# EasyEDA schematic SCH_ECG-business-card_2025-07-31.json
TITLE: ECG Business Card; REV: 1.0; Date: 2025-07-29; Sheet: 1/1; Drawn By: Ali Ashrafy; Company: Ashrafy Industries
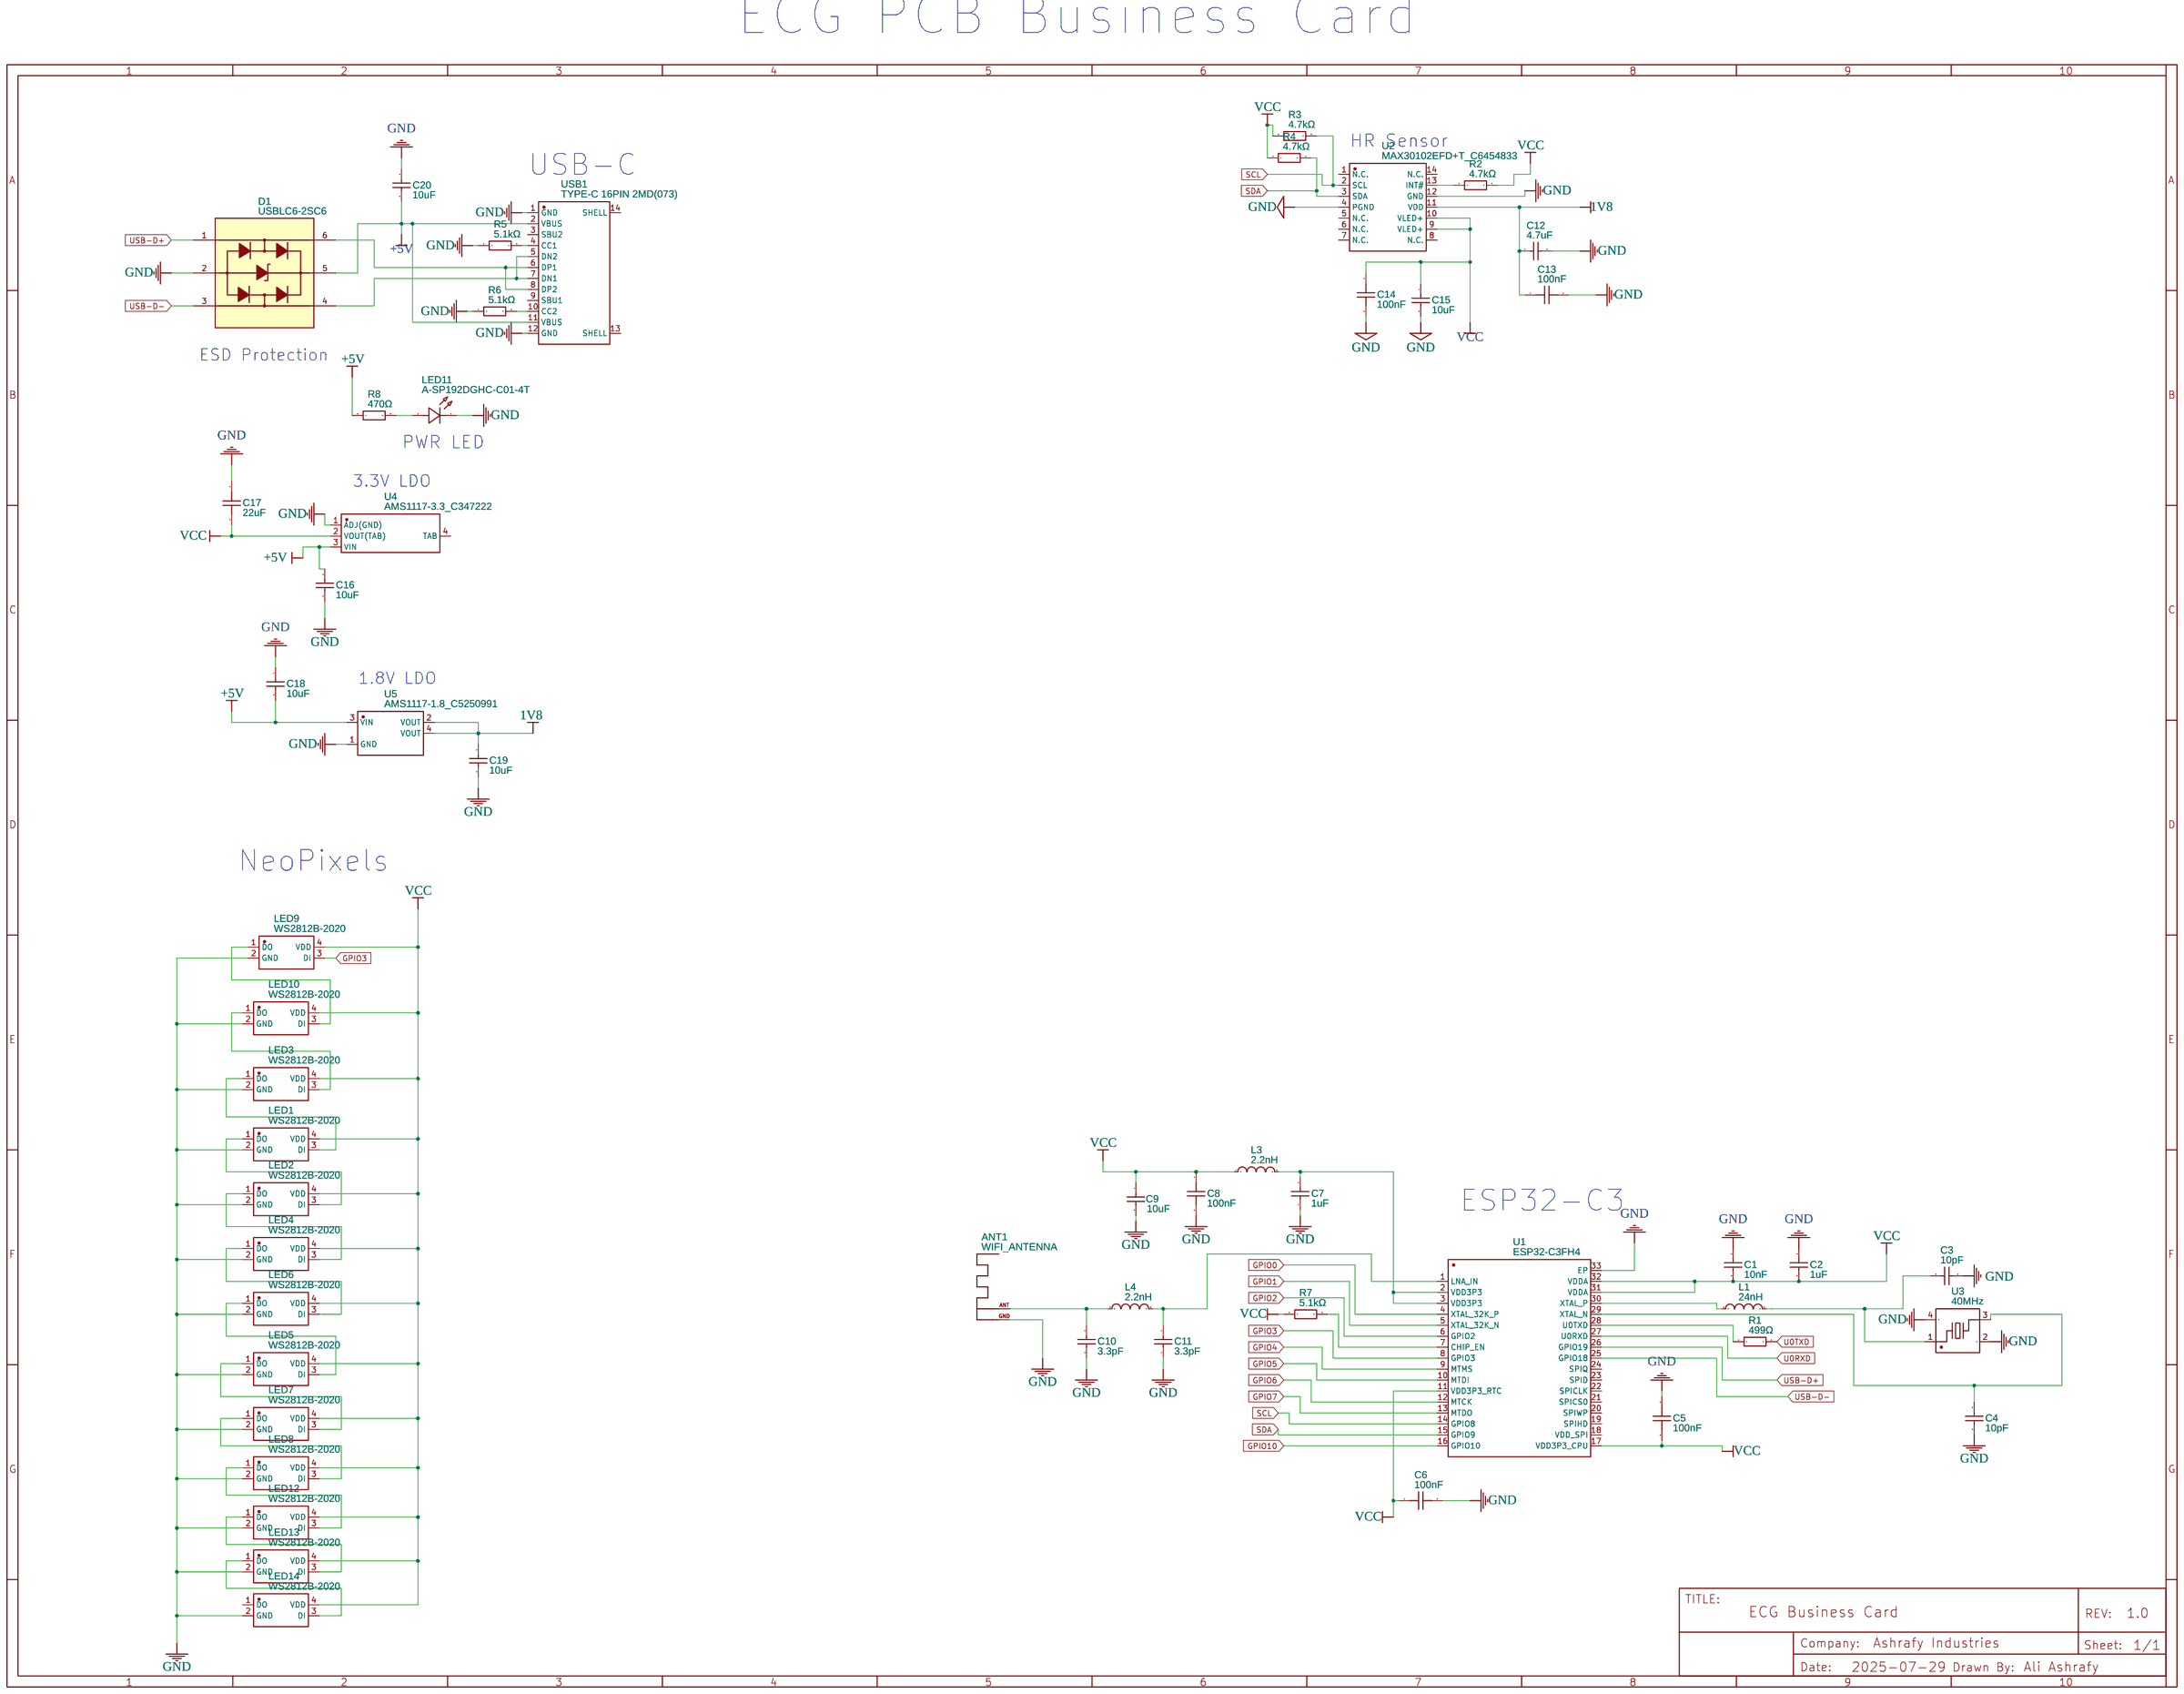
[diagram p0: schematic sheet]

## Parts
ANT1  WIFI_ANTENNA  [WIFI ANTENNA MIFA INVERTED F ANTENNA]
C1  10nF  [C0603]
C2  1uF  [C0805]
C3  10pF  [C0402]
C4  10pF  [C0402]
C5  100nF  [C0603]
C6  100nF  [C0603]
C7  1uF  [C0805]
C8  100nF  [C0603]
C9  10uF  [C1206]
C10  3.3pF  [C0402]
C11  3.3pF  [C0402]
C12  4.7uF  [C0603]
C13  100nF  [C0603]
C14  100nF  [C0603]
C15  10uF  [C1206]
C16  10uF  [C1206]
C17  22uF  [C0805]
C18  10uF  [C1206]
C19  10uF  [C1206]
C20  10uF  [C1206]
D1  USBLC6-2SC6  [SOT-23-6_L2.9-W1.6-P0.95-LS2.8-BL]
L1  24nH  [L0201]
L3  2.2nH  [L0402]
L4  2.2nH  [L0402]
LED1  WS2812B-2020  [LED-SMD_4P-L2.0-W2.0-TL_WS2812B-2020]
LED2  WS2812B-2020  [LED-SMD_4P-L2.0-W2.0-TL_WS2812B-2020]
LED3  WS2812B-2020  [LED-SMD_4P-L2.0-W2.0-TL_WS2812B-2020]
LED4  WS2812B-2020  [LED-SMD_4P-L2.0-W2.0-TL_WS2812B-2020]
LED5  WS2812B-2020  [LED-SMD_4P-L2.0-W2.0-TL_WS2812B-2020]
LED6  WS2812B-2020  [LED-SMD_4P-L2.0-W2.0-TL_WS2812B-2020]
LED7  WS2812B-2020  [LED-SMD_4P-L2.0-W2.0-TL_WS2812B-2020]
LED8  WS2812B-2020  [LED-SMD_4P-L2.0-W2.0-TL_WS2812B-2020]
LED9  WS2812B-2020  [LED-SMD_4P-L2.0-W2.0-TL_WS2812B-2020]
LED10  WS2812B-2020  [LED-SMD_4P-L2.0-W2.0-TL_WS2812B-2020]
LED11  A-SP192DGHC-C01-4T  [LED0603-FD]
LED12  WS2812B-2020  [LED-SMD_4P-L2.0-W2.0-TL_WS2812B-2020]
LED13  WS2812B-2020  [LED-SMD_4P-L2.0-W2.0-TL_WS2812B-2020]
LED14  WS2812B-2020  [LED-SMD_4P-L2.0-W2.0-TL_WS2812B-2020]
R1  499Ω  [R0402]
R2  4.7kΩ  [R0603]
R3  4.7kΩ  [R0603]
R4  4.7kΩ  [R0603]
R5  5.1kΩ  [R0603]
R6  5.1kΩ  [R0603]
R7  5.1kΩ  [R0603]
R8  470Ω  [R0603]
U1  ESP32-C3FH4  [QFN-32_L5.0-W5.0-P0.50-TL-EP3.7]
U2  MAX30102EFD+T_C6454833  [OESIP-14_L5.6-W3.3-P0.80-TL]
U3  40MHz  [CRYSTAL-SMD_4P-L3.2-W2.5-BL]
U4  AMS1117-3.3_C347222  [SOT-223-4_L6.5-W3.5-P2.30-LS7.0-BR]
U5  AMS1117-1.8_C5250991  [SOT-223-3_L6.7-W3.7-P2.30-LS7.0-BR]
USB1  TYPE-C 16PIN 2MD(073)  [USB-C-SMD_TYPE-C-6PIN-2MD-073]

## Library data of the parts
ANT1 = WIFI_ANTENNA: Contributor: Schinken
C1 = CC0603KRX7R9BB103: Supplier: LCSC; Manufacturer: YAGEO(国巨); Supplier Part: C100042; JLCPCB Part Class: Extended Part
C2 C7 = CL21B105KBFNNNE: Supplier: LCSC; Manufacturer: SAMSUNG(三星); Supplier Part: C28323; JLCPCB Part Class: Basic Part
C3 C4 = GRM1555C1H100JA01D: Supplier: LCSC; Manufacturer: muRata(村田); Supplier Part: C76946; JLCPCB Part Class: Extended Part
C5 C8 C13 C14 = CC0603KRX7R9BB104: Supplier: LCSC; Manufacturer: YAGEO(国巨); Supplier Part: C14663; JLCPCB Part Class: Basic Part
C6 = CC0603KRX7R9BB104: Supplier: LCSC; Manufacturer: YAGEO(国巨); Supplier Part: C14663; JLCPCB Part Class: Basic Part; link: https://lcsc.com/eda_search?q=C14663&%26type=1&ref=editor
C9 C15 C16 C18 C19 = CL31A106KBHNNNE: Supplier: LCSC; Manufacturer: SAMSUNG(三星); Supplier Part: C13585; JLCPCB Part Class: Basic Part
C10 C11 = GJM1555C1H3R3BB01D: Supplier: LCSC; Manufacturer: muRata(村田); Supplier Part: C76906; JLCPCB Part Class: Extended Part
C12 = CL10A475KP8NNNC: Supplier: LCSC; Manufacturer: SAMSUNG(三星); Supplier Part: C1705; JLCPCB Part Class: Extended Part
C17 = CL21A226MAYNNNE: Contributor: LCSC; Supplier: LCSC; Supplier Part: C602037; Manufacturer: SAMSUNG(三星); JLCPCB Part Class: Extended Part
C20 = CL31A106KBHNNNE: Supplier: LCSC; Manufacturer: SAMSUNG(三星); Supplier Part: C13585; JLCPCB Part Class: Basic Part; link: https://lcsc.com/eda_search?q=C13585&%26type=1&ref=editor
D1 = USBLC6-2SC6: Supplier: LCSC; Manufacturer: ST(意法半导体); Supplier Part: C7519; JLCPCB Part Class: Extended Part
L1 = LQP03TN24NH02D: Contributor: LCSC; Supplier: LCSC; Supplier Part: C206441; Manufacturer: muRata(村田); JLCPCB Part Class: Extended Part
L3 L4 = LQG15HS2N2S02D: Supplier: LCSC; Manufacturer: muRata(村田); Supplier Part: C86061; JLCPCB Part Class: Extended Part
LED1-LED10 LED12-LED14 = WS2812B-2020: Contributor: LCSC; Supplier: LCSC; Supplier Part: C965555; Manufacturer: worldsemi; JLCPCB Part Class: Extended Part
LED11 = A-SP192DGHC-C01-4T: Supplier: LCSC; Supplier Part: C19171301; Manufacturer: Amicc(欧密格光电); JLCPCB Part Class: Extended Part; Contributor: lcsc
R1 = RC0402FR-07499RL: Supplier: LCSC; Manufacturer: YAGEO(国巨); Supplier Part: C137970; JLCPCB Part Class: Extended Part
R2-R4 = RC0603FR-074K7L: Supplier: LCSC; Manufacturer: YAGEO(国巨); Supplier Part: C99782; JLCPCB Part Class: Extended Part
R5-R7 = RC0603FR-075K1L: Supplier: LCSC; Manufacturer: YAGEO(国巨); Supplier Part: C105580; JLCPCB Part Class: Extended Part
R8 = RC0603FR-07470RL: Supplier: LCSC; Manufacturer: YAGEO(国巨); Supplier Part: C114669; JLCPCB Part Class: Extended Part
U1 = ESP32-C3FH4: Contributor: LCSC; Supplier: LCSC; Supplier Part: C2858491; Manufacturer: ESPRESSIF(乐鑫); JLCPCB Part Class: Extended Part; Package Display: No
U2 = MAX30102EFD+T_C6454833: Supplier: LCSC; Supplier Part: C6454833; Manufacturer: ADI(亚德诺)/MAXIM(美信); Manufacturer Part: MAX30102EFD+T; JLCPCB Part Class: Extended Part
U3 = L327S400H11L: Supplier: LCSC; Supplier Part: C5261245; Manufacturer: Lucki(蓝晶); Contributor: lcsc; JLCPCB Part Class: Extended Part
U4 = AMS1117-3.3_C347222: Contributor: LCSC; Supplier: LCSC; Supplier Part: C347222; Manufacturer: UMW(友台半导体); Manufacturer Part: AMS1117-3.3; JLCPCB Part Class: Extended Part
U5 = AMS1117-1.8_C5250991: Supplier: LCSC; Supplier Part: C5250991; Manufacturer: TWGMC(台湾迪嘉); Manufacturer Part: AMS1117-1.8; JLCPCB Part Class: Extended Part; Contributor: lcsc
USB1 = TYPE-C 16PIN 2MD(073): Contributor: LCSC; Supplier: LCSC; Supplier Part: C2765186; Manufacturer: SHOU HAN(首韩); JLCPCB Part Class: Extended Part

## Nets
1V8: C12.1 C13.1 C19.1 U2.11(VDD) U5.2(VOUT) U5.4(VOUT)
+5V: C16.1 C18.2 C20.2 D1.5 R8.1 U4.3(VIN) U5.3(VIN) USB1.2(VBUS) USB1.11(VBUS)
GND: ANT1.GND C1.2 C2.2 C3.2 C4.2 C5.1 C6.2 C7.1 C8.2 C9.2 C10.1 C11.1 C12.2 C13.2 C14.2 C15.2 C16.2 C17.1 C18.1 C19.2 C20.1 D1.2 LED1.2(GND) LED2.2(GND) LED3.2(GND) LED4.2(GND) LED5.2(GND) LED6.2(GND) LED7.2(GND) LED8.2(GND) LED9.2(GND) LED10.2(GND) LED11.2(K) LED12.2(GND) LED13.2(GND) LED14.2(GND) R5.1 R6.1 U1.33(EP) U2.4(PGND) U2.12(GND) U3.2(GND) U3.4(GND) U4.1(ADJ(GND)) U5.1(GND) USB1.1(GND) USB1.12(GND)
VCC: C1.1 C2.1 C5.2 C6.1 C8.1 C9.1 C14.1 C15.1 C17.2 L3.1 LED1.4(VDD) LED2.4(VDD) LED3.4(VDD) LED4.4(VDD) LED5.4(VDD) LED6.4(VDD) LED7.4(VDD) LED8.4(VDD) LED9.4(VDD) LED10.4(VDD) LED12.4(VDD) LED13.4(VDD) LED14.4(VDD) R2.2 R3.1 R4.1 R7.1 U1.11(VDD3P3_RTC) U1.17(VDD3P3_CPU) U1.31(VDDA) U1.32(VDDA) U2.9(VLED+) U2.10(VLED+) U4.2(VOUT(TAB))
GPIO0: U1.4(XTAL_32K_P)
GPIO1: U1.5(XTAL_32K_N)
GPIO2: U1.6(GPIO2)
GPIO3: LED9.3(DI) U1.8(GPIO3)
GPIO4: U1.9(MTMS)
GPIO5: U1.10(MTDI)
GPIO6: U1.12(MTCK)
GPIO7: U1.13(MTDO)
GPIO10: U1.16(GPIO10)
SCL: R3.2 U1.14(GPIO8) U2.2(SCL)
SDA: R4.2 U1.15(GPIO9) U2.3(SDA)
U0RXD: U1.27(U0RXD)
U0TXD: R1.2
USB-D+: D1.1 U1.26(GPIO19)
USB-D-: D1.3 U1.25(GPIO18)
Net-(ANT1-ANT): ANT1.ANT C10.2 L4.1
Net-(C3-1): C3.1 L1.2 U3.1
Net-(C4-1): C4.1 U1.29(XTAL_N) U3.3
Net-(C7-2): C7.2 L3.2 U1.2(VDD3P3) U1.3(VDD3P3)
Net-(C11-2): C11.2 L4.2 U1.1(LNA_IN)
Net-(D1-4): D1.4 USB1.5(DN2) USB1.7(DN1)
Net-(D1-6): D1.6 USB1.6(DP1) USB1.8(DP2)
Net-(L1-1): L1.1 U1.30(XTAL_P)
Net-(LED1-1): LED1.1(DO) LED2.3(DI)
Net-(LED1-3): LED1.3(DI) LED3.1(DO)
Net-(LED2-1): LED2.1(DO) LED4.3(DI)
Net-(LED3-3): LED3.3(DI) LED10.1(DO)
Net-(LED4-1): LED4.1(DO) LED6.3(DI)
Net-(LED5-1): LED5.1(DO) LED7.3(DI)
Net-(LED5-3): LED5.3(DI) LED6.1(DO)
Net-(LED7-1): LED7.1(DO) LED8.3(DI)
Net-(LED8-1): LED8.1(DO) LED12.3(DI)
Net-(LED9-1): LED9.1(DO) LED10.3(DI)
Net-(LED11-1): LED11.1(A) R8.2
Net-(LED12-1): LED12.1(DO) LED13.3(DI)
Net-(LED13-1): LED13.1(DO) LED14.3(DI)
Net-(R1-1): R1.1 U1.28(U0TXD)
Net-(R2-1): R2.1 U2.13(INT#)
Net-(R5-2): R5.2 USB1.4(CC1)
Net-(R6-2): R6.2 USB1.10(CC2)
Net-(R7-2): R7.2 U1.7(CHIP_EN)

Not connected (* = marked no-connect by the designer): LED14 1(DO); U1 18(VDD_SPI) 19(SPIHD) 20(SPIWP) 21(SPICS0) 22(SPICLK) 23(SPID) 24(SPIQ); U2 1(N.C.) 5(N.C.) 6(N.C.) 7(N.C.) 8(N.C.) 14(N.C.); U4 4(TAB); USB1 3(SBU2) 9(SBU1) 13(SHELL) 14(SHELL)

## Notes on the sheet
- ECG PCB Business Card
- HR Sensor
- USB-C
- ESD Protection
- PWR LED
- 3.3V LDO
- 1.8V LDO
- NeoPixels
- ESP32-C3
